# Altium schematic sheet Power Supply.SchDoc
size A4; SheetNumber: 3; SheetTotal: 5
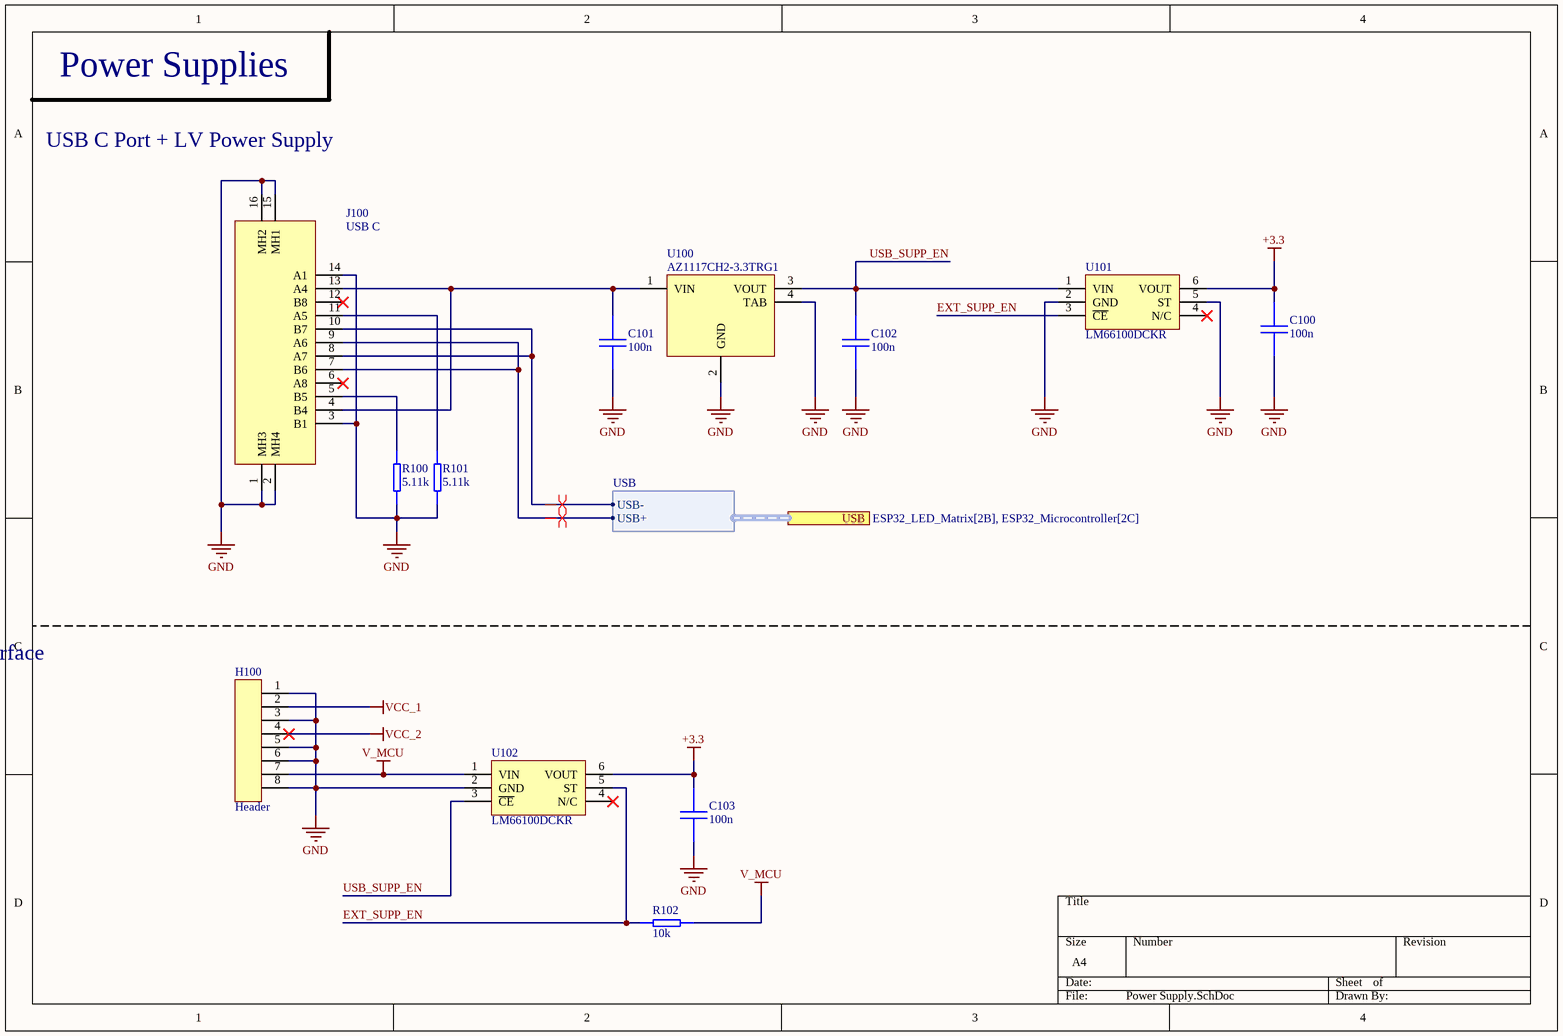
[diagram p0: Power Supply.SchDoc]

## Parts
C100  100n  [CAP0805]
C101  100n  [CAP0805]
C102  100n  [CAP0805]
C103  100n  [CAP0805]
H100  Header  [Header_1X8]
J100  USB C  [USB TYPE C 12 PIN]
R100  5.11k  [RESC0805]
R101  5.11k  [RESC0805]
R102  10k  [RESC0805]
U100  AZ1117CH2-3.3TRG1  [SOT223]
U101  LM66100DCKR  [SC70-6]
U102  LM66100DCKR  [SC70-6]

## Ports
USB (harness USB, see ESP32_LED_Matrix[2B], ESP32_Microcontroller[2C])

## Harnesses
USB: USB-, USB+

## Nets
+3.3: C100.1 C103.1 U101.6(VOUT) U102.6(VOUT)
GND: C100.2 C101.2 C102.2 C103.2 H100.1 H100.3 H100.5 H100.6 H100.8 J100.1(MH3) J100.2(MH4) J100.3(B1) J100.14(A1) J100.15(MH1) J100.16(MH2) R100.1 R101.1 U100.2(GND) U100.4(TAB) U101.2(GND) U101.5(ST) U102.2(GND)
V_MCU: H100.7 R102.2 U102.1(VIN)
VCC_1: H100.2
VCC_2: H100.4
EXT_SUPP_EN: R102.1 U101.3(~{CE}) U102.5(ST)
USB_SUPP_EN: C102.1 U100.3(VOUT) U101.1(VIN) U102.3(~{CE})
NetC101_1: C101.1 J100.4(B4) J100.13(A4) U100.1(VIN)
NetJ100_5: J100.5(B5) R100.2
NetJ100_7: J100.7(B6) J100.9(A6) ; port USB.USB+
NetJ100_8: J100.8(A7) J100.10(B7) ; port USB.USB-
NetJ100_11: J100.11(A5) R101.2

Not connected (* = marked no-connect by the designer): J100 6(A8)* 12(B8)*; U101 4(N/C)*; U102 4(N/C)*

## Layout directives
differential pair: NetJ100_7, NetJ100_8

## Notes on the sheet
- Power Supplies
- USB C Port + LV Power Supply
- Power Interface

## Library data of the parts
C100-C103 = Capacitor - Non Polarized: Non Polarized Capacitor
H100 = 8-Pin Header: System: Connector
J100 = USB Type C Connector 12 Pin
R100-R102 = Resistor
U100 = AZ1117CH2-3.3TRG1_1: 3.3V Linear Voltage Regulator
U101 U102 = LM66100DCKR: 5.5-V, 1.5-A 79-mΩ, Low IQ Ideal Diode With Input Polarity Protection; Manufacturer_Name: Texas Instruments; Datasheet Link: http://www.ti.com/lit/gpn/LM66100; Height: 1.1mm; Manufacturer_Part_Number: LM66100DCKR; Mouser Part Number: 595-LM66100DCKR; Mouser Price/Stock: https://www.mouser.co.uk/ProductDetail/Texas-Instruments/LM66100DCKR?qs=vLWxofP3U2y2yPPrXoBBoA%3D%3D; Arrow Part Number: LM66100DCKR; Arrow Price/Stock: https://www.arrow.com/en/products/lm66100dckr/texas-instruments?region=nac